# EAGLE design 20200406_FrontBoard_EA_04 (EAGLE 9.5.1)

## Sheet 1 of 2
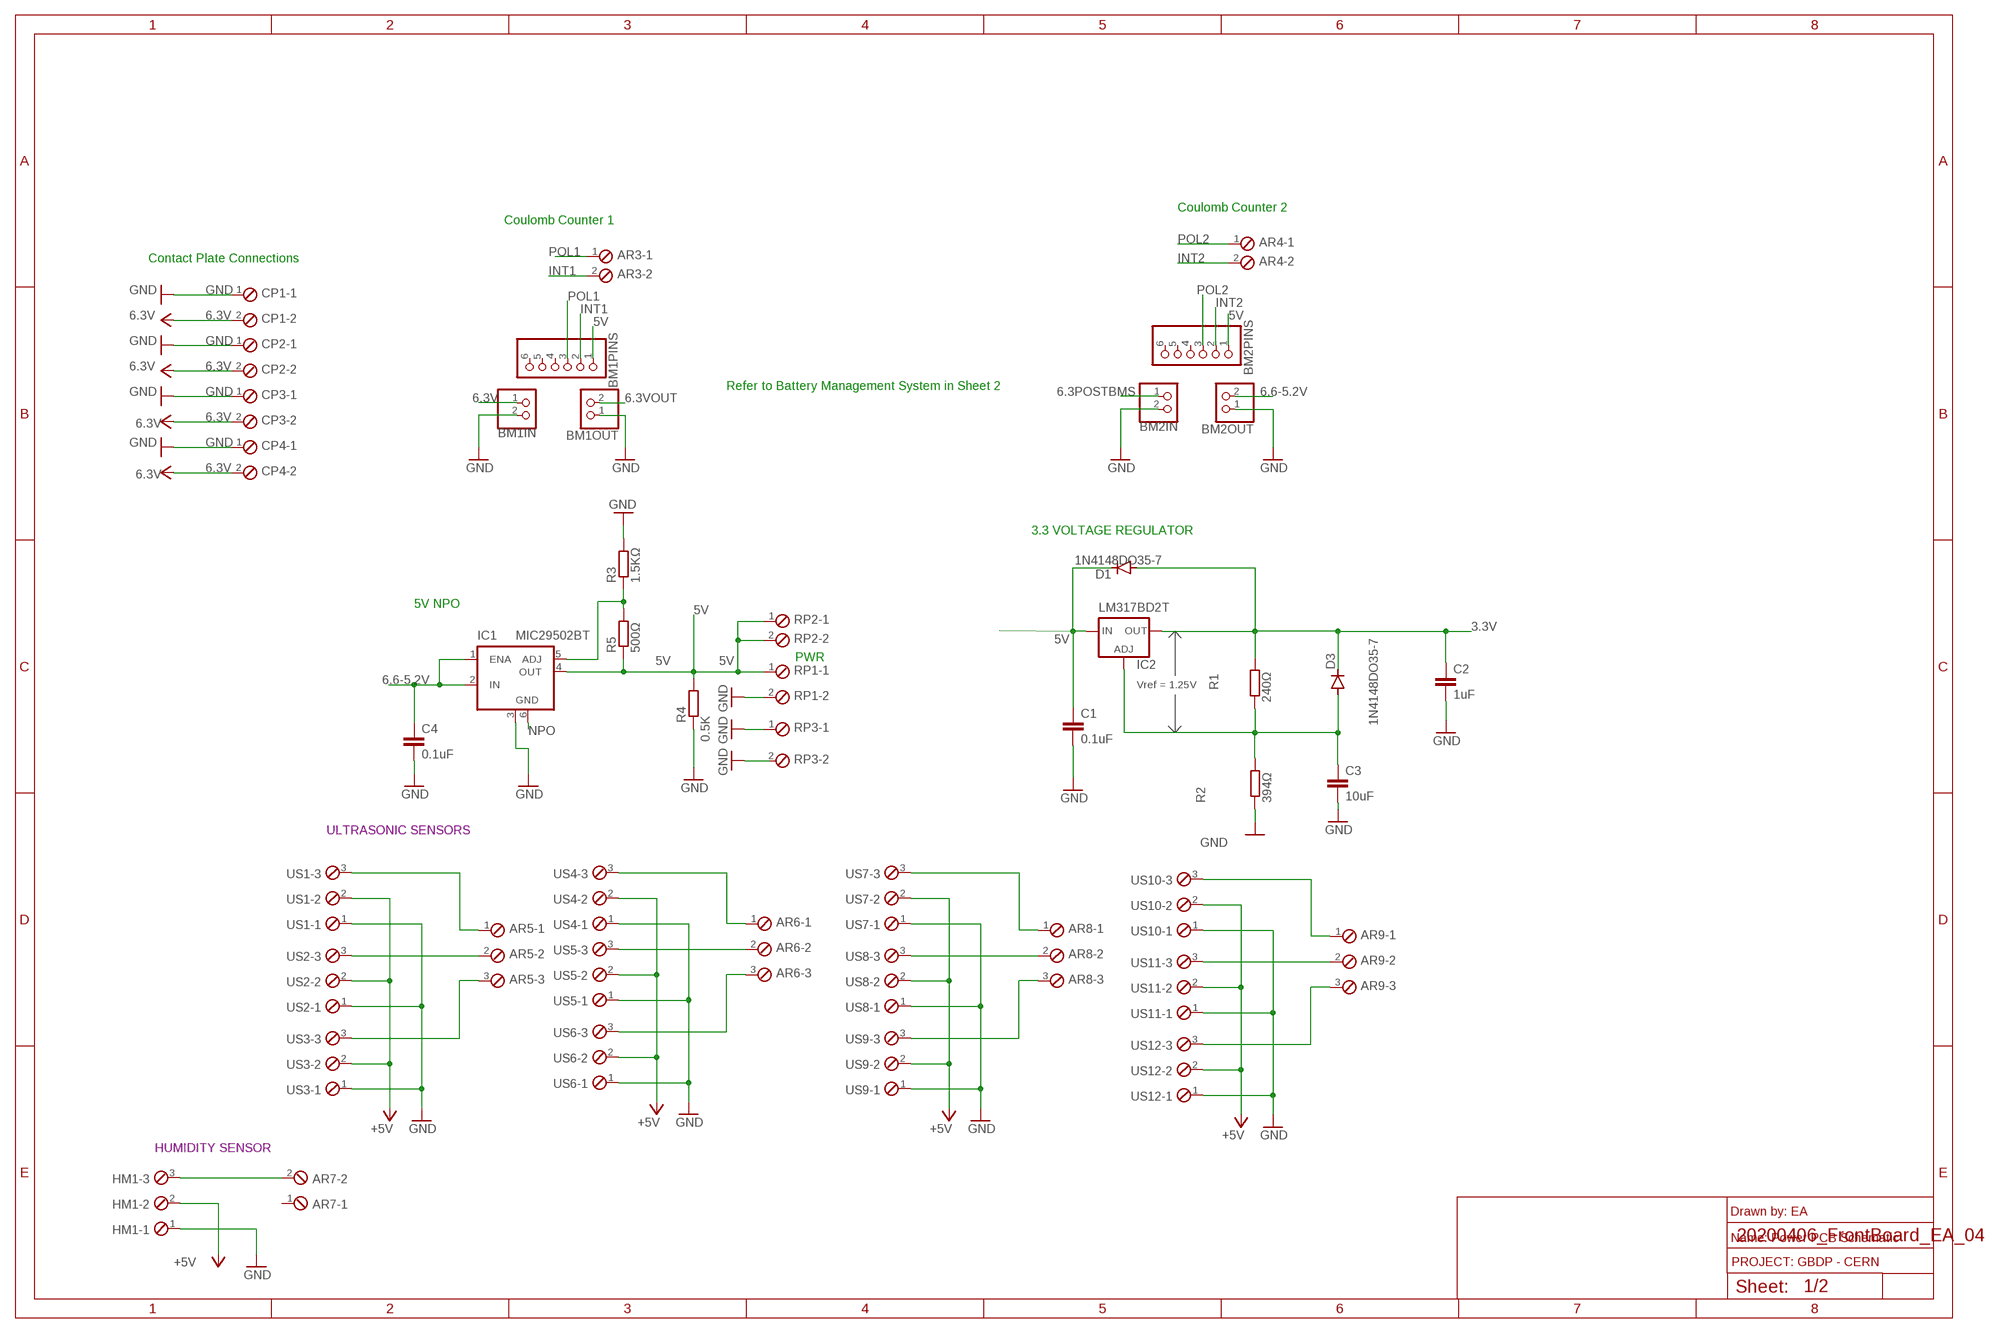
[diagram p0: schematic, sheet 1]

### Parts
AR3  MPT2  [2POL254]
AR4  MPT2  [2POL254]
AR5  MPT3  [3POL254]
AR6  MPT3  [3POL254]
AR7  MPT2  [2POL254]
AR8  MPT3  [3POL254]
AR9  MPT3  [3POL254]
BM1IN  PINHD-1X2  [1X02]
BM1OUT  PINHD-1X2  [1X02]
BM1PINS  PINHD-1X6  [1X06]
BM2IN  PINHD-1X2  [1X02]
BM2OUT  PINHD-1X2  [1X02]
BM2PINS  PINHD-1X6  [1X06]
C1  0.1uF  C-EU025-025X050  [C025-025X050]
C2  1uF  C-EU025-025X050  [C025-025X050]
C3  10uF  C-EU025-025X050  [C025-025X050]
C4  0.1uF  C-EU025-025X050  [C025-025X050]
CP1  MPT2  [2POL254]
CP2  MPT2  [2POL254]
CP3  MPT2  [2POL254]
CP4  MPT2  [2POL254]
D1  1N4148DO35-7  [DO35-7]
D3  1N4148DO35-7  [DO35-7]
HM1  MPT3  [3POL254]
IC1  MIC29502BT  [TO263-5]
IC2  LM317BD2T  [D2PACK]
R1  240Ω  R-EU_0204/7  [0204/7]
R2  394Ω  R-EU_0204/7  [0204/7]
R3  1.5KΩ  R-EU_0204/7  [0204/7]
R4  0.5K  R-EU_0204/7  [0204/7]
R5  500Ω  R-EU_0204/7  [0204/7]
RP1  MPT2  [2POL254]
RP2  MPT2  [2POL254]
RP3  MPT2  [2POL254]
US1  MPT3  [3POL254]
US2  MPT3  [3POL254]
US3  MPT3  [3POL254]
US4  MPT3  [3POL254]
US5  MPT3  [3POL254]
US6  MPT3  [3POL254]
US7  MPT3  [3POL254]
US8  MPT3  [3POL254]
US9  MPT3  [3POL254]
US10  MPT3  [3POL254]
US11  MPT3  [3POL254]
US12  MPT3  [3POL254]

### Nets
3.3V: C2.1 D1.A D3.C IC2.2(OUT) R1.2
5V: BM1PINS.1 BM2PINS.1 C1.1 D1.C IC1.4(OUT) IC2.3(IN) R4.2 R5.1 RP1.1 RP2.1 RP2.2
6.3POSTBMS: BM2IN.1 ; also sheet 2
6.3V: BM1IN.1 CP1.2 CP2.2 CP3.2 CP4.2 ; supply symbol labelled VCC
6.3VOUT: BM1OUT.2 ; also sheet 2
6.6-5.2V: BM2OUT.2 C4.1 IC1.1(ENA) IC1.2(IN)
+5V: HM1.2 US1.2 US2.2 US3.2 US4.2 US5.2 US6.2 US7.2 US8.2 US9.2 US10.2 US11.2 US12.2
GND: BM1IN.2 BM1OUT.1 BM2IN.2 BM2OUT.1 C1.2 C2.2 C3.2 C4.2 CP1.1 CP2.1 CP3.1 CP4.1 HM1.1 IC1.3(GND) R2.1 R3.2 R4.1 RP1.2 RP3.1 RP3.2 US1.1 US2.1 US3.1 US4.1 US5.1 US6.1 US7.1 US8.1 US9.1 US10.1 US11.1 US12.1 ; also sheet 2
INT1: AR3.2 BM1PINS.2
INT2: AR4.2 BM2PINS.2
N$1: C3.1 D3.A IC2.1(ADJ) R1.1 R2.2
N$2: AR8.3 US9.3
N$4: IC1.5(ADJ) R3.1 R5.2
N$6: AR5.3 US3.3
N$9: AR5.2 US2.3
N$13: AR5.1 US1.3
N$14: AR6.3 US6.3
N$15: AR6.2 US5.3
N$16: AR6.1 US4.3
N$17: AR7.2 HM1.3
N$19: AR8.2 US8.3
N$20: AR8.1 US7.3
N$21: AR9.3 US12.3
N$22: AR9.2 US11.3
N$23: AR9.1 US10.3
NPO: IC1.6(GND)
POL1: AR3.1 BM1PINS.3
POL2: AR4.1 BM2PINS.3
Unconnected: AR7.1 BM1PINS.4 BM1PINS.5 BM1PINS.6 BM2PINS.4 BM2PINS.5 BM2PINS.6

### Notes on the sheet
- Coulomb Counter 2
- Coulomb Counter 1
- Contact Plate Connections
- Refer to Battery Management System in Sheet 2
- 3.3 VOLTAGE REGULATOR
- 5V NPO
- PWR
- Vref = 1.25V
- ULTRASONIC SENSORS
- HUMIDITY SENSOR
- Drawn by: EA
- Name: Power PCB Schematic
- PROJECT: GBDP - CERN

## Sheet 2 of 2
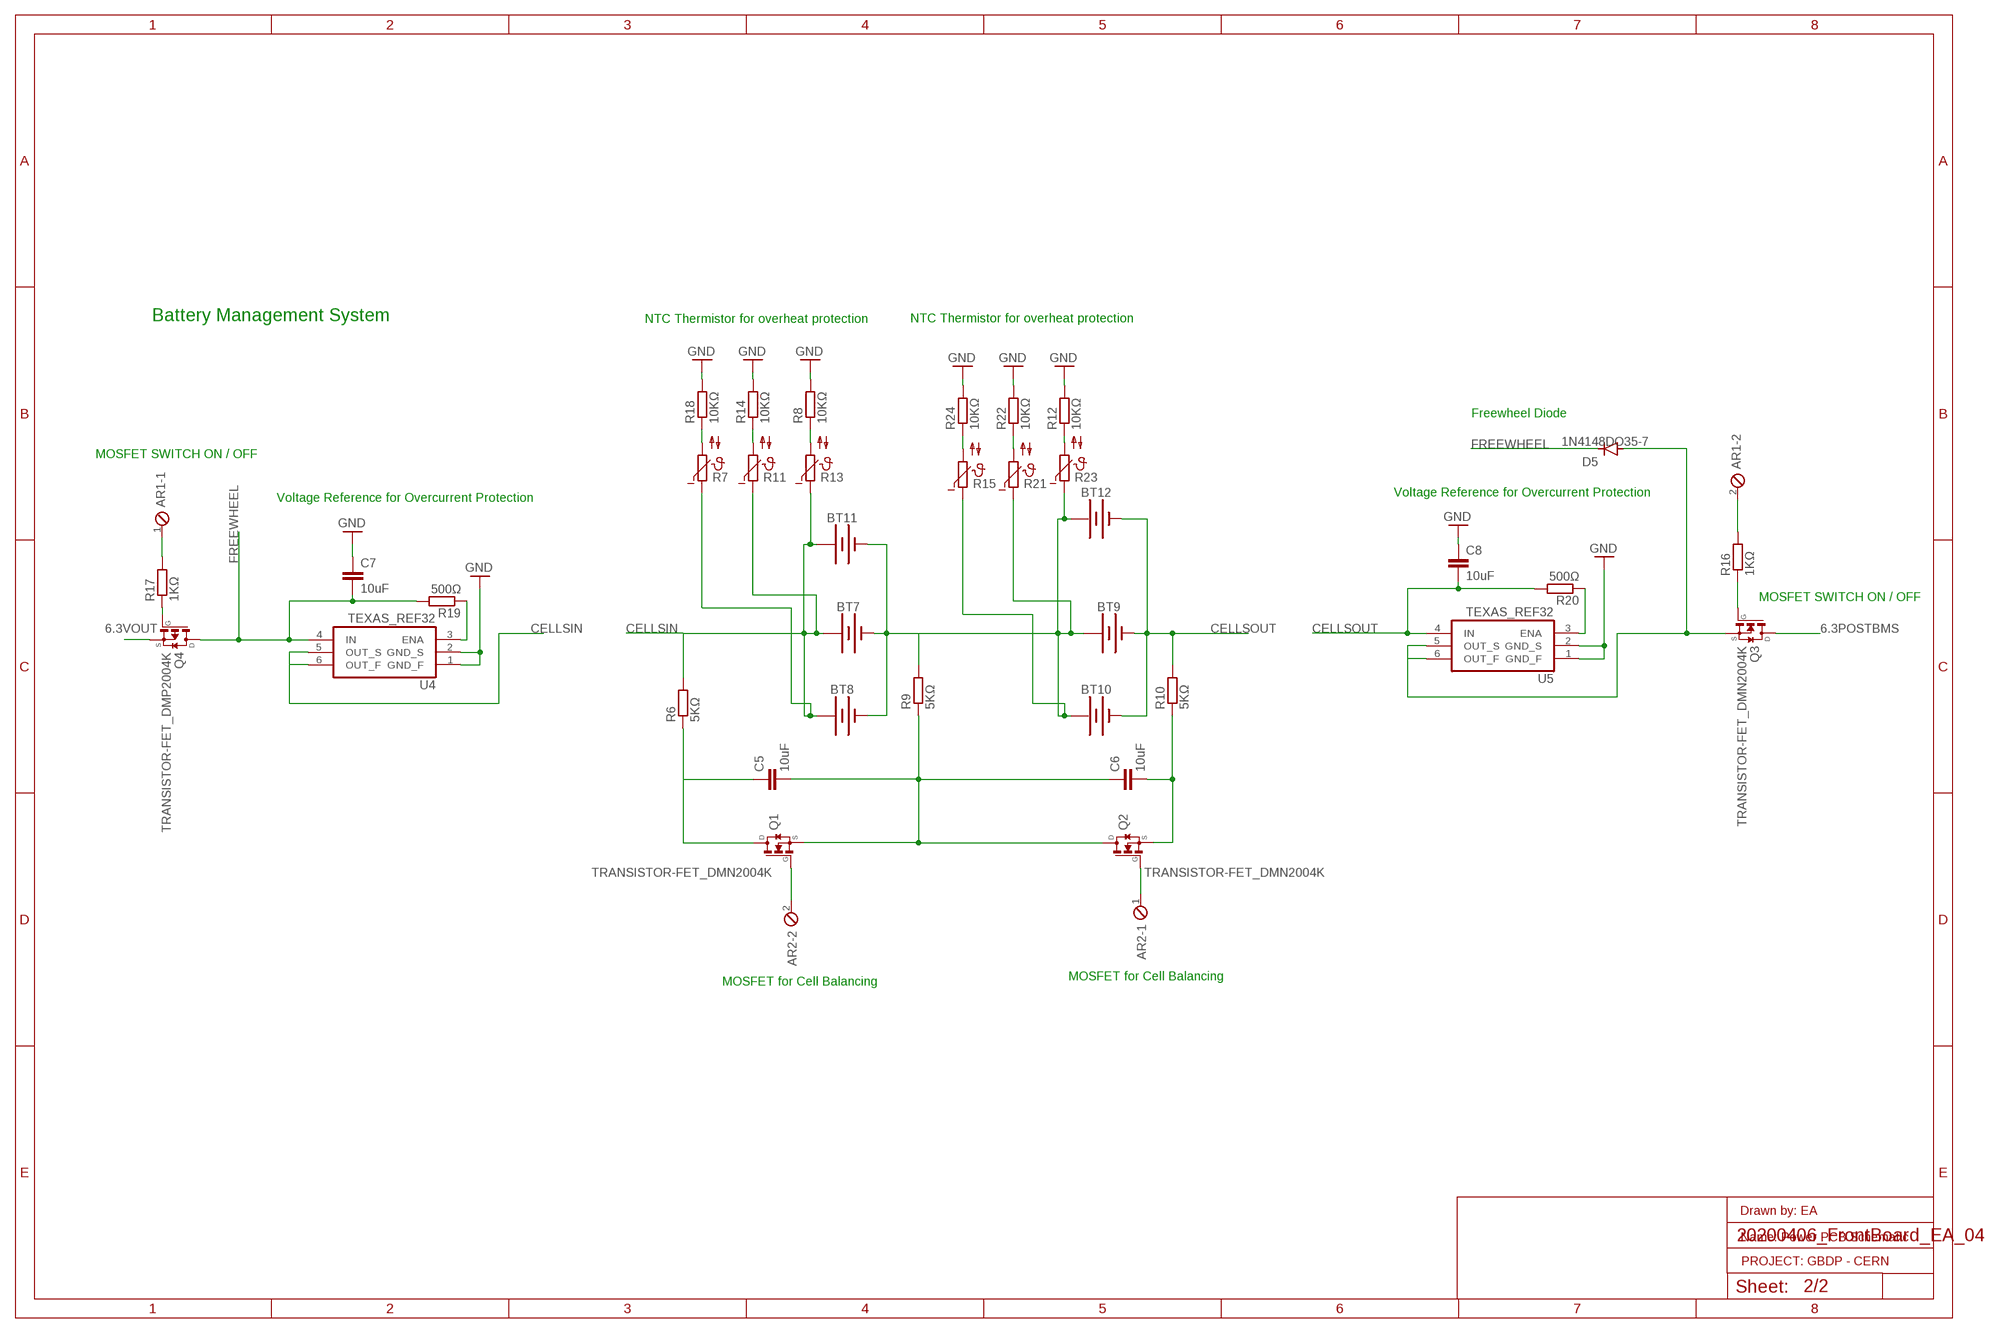
[diagram p1: schematic, sheet 2]

### Parts
AR1  MPT2  [2POL254]
AR2  MPT2  [2POL254]
BT7  BATTERY-18650  [BATTERY_18650-HOLDER]
BT8  BATTERY-18650  [BATTERY_18650-HOLDER]
BT9  BATTERY-18650  [BATTERY_18650-HOLDER]
BT10  BATTERY-18650  [BATTERY_18650-HOLDER]
BT11  BATTERY-18650  [BATTERY_18650-HOLDER]
BT12  BATTERY-18650  [BATTERY_18650-HOLDER]
C5  10uF  C-EU025-025X050  [C025-025X050]
C6  10uF  C-EU025-025X050  [C025-025X050]
C7  10uF  C-EU025-025X050  [C025-025X050]
C8  10uF  C-EU025-025X050  [C025-025X050]
D5  1N4148DO35-7  [DO35-7]
Q1  TRANSISTOR-FET_DMN2004K  [TRANSISTOR-FET_SOT23]
Q2  TRANSISTOR-FET_DMN2004K  [TRANSISTOR-FET_SOT23]
Q3  TRANSISTOR-FET_DMN2004K  [TRANSISTOR-FET_SOT23]
Q4  TRANSISTOR-FET_DMP2004K  [TRANSISTOR-FET_SOT23]
R6  5KΩ  R-EU_0204/7  [0204/7]
R7  NTC640  [P640]
R8  10KΩ  R-EU_0204/7  [0204/7]
R9  5KΩ  R-EU_0204/7  [0204/7]
R10  5KΩ  R-EU_0204/7  [0204/7]
R11  NTC640  [P640]
R12  10KΩ  R-EU_0204/7  [0204/7]
R13  NTC640  [P640]
R14  10KΩ  R-EU_0204/7  [0204/7]
R15  NTC640  [P640]
R16  1KΩ  R-EU_0204/7  [0204/7]
R17  1KΩ  R-EU_0204/7  [0204/7]
R18  10KΩ  R-EU_0204/7  [0204/7]
R19  500Ω  R-EU_0204/7  [0204/7]
R20  500Ω  R-EU_0204/7  [0204/7]
R21  NTC640  [P640]
R22  10KΩ  R-EU_0204/7  [0204/7]
R23  NTC640  [P640]
R24  10KΩ  R-EU_0204/7  [0204/7]
U4  TEXAS_REF32  [TEXAS_SOT23-6]
U5  TEXAS_REF32  [TEXAS_SOT23-6]

### Nets
6.3POSTBMS: Q3.3(D) ; also sheet 1
6.3VOUT: Q4.2(S) ; also sheet 1
CELLSIN: BT7.PWR@1(+) BT8.PWR@1(+) BT11.PWR@1(+) R6.2 R7.1 R11.1 R13.1 U4.5(OUT_S) U4.6(OUT_F)
CELLSOUT: BT9.GND@1(-) BT10.GND@1(-) BT12.GND@1(-) C8.2 R10.2 R20.2 U5.4(IN)
FREEWHEEL: C7.2 D5.C Q4.3(D) R19.2 U4.4(IN)
GND: C7.1 C8.1 R8.2 R12.2 R14.2 R18.2 R22.2 R24.2 U4.1(GND_F) U4.2(GND_S) U5.1(GND_F) U5.2(GND_S) ; also sheet 1
N$5: C5.2 C6.1 Q1.2(S) Q2.3(D) R9.1
N$7: C6.2 Q2.2(S) R10.1
N$8: AR2.2 Q1.1(G)
N$10: AR2.1 Q2.1(G)
N$12: AR1.2 R16.2
N$18: D5.A Q3.2(S) U5.5(OUT_S) U5.6(OUT_F)
N$24: Q3.1(G) R16.1
N$25: Q4.1(G) R17.1
N$26: AR1.1 R17.2
N$27: R8.1 R13.2
N$28: R21.2 R22.1
N$29: C5.1 Q1.3(D) R6.1
N$30: R19.1 U4.3(ENA)
N$32: R12.1 R23.2
N$33: R20.1 U5.3(ENA)
N$35: R11.2 R14.1
N$36: R7.2 R18.1
N$37: BT7.GND@1(-) BT8.GND@1(-) BT9.PWR@1(+) BT10.PWR@1(+) BT11.GND@1(-) BT12.PWR@1(+) R9.2 R15.1 R21.1 R23.1
N$38: R15.2 R24.1

### Notes on the sheet
- Battery Management System | NTC Thermistor for overheat protection | NTC Thermistor for overheat protection
- Freewheel Diode
- MOSFET SWITCH ON / OFF
- Voltage Reference for Overcurrent Protection
- Voltage Reference for Overcurrent Protection
- MOSFET SWITCH ON / OFF
- MOSFET for Cell Balancing
- MOSFET for Cell Balancing
- Drawn by: EA
- Name: Power PCB Schematic
- PROJECT: GBDP - CERN

## Library data of the parts
AR1-AR4 AR7 CP1-CP4 RP1-RP3 = con-phoenix-254_edited:MPT2: PHOENIX CONNECTOR; OC_FARNELL: unknown; OC_NEWARK: unknown
AR5 AR6 AR8 AR9 HM1 US1-US12 = con-phoenix-254_edited:MPT3: PHOENIX CONNECTOR; OC_FARNELL: unknown; OC_NEWARK: unknown
BM1IN BM1OUT BM2IN BM2OUT = pinhead:PINHD-1X2: PIN HEADER
BM1PINS BM2PINS = pinhead:PINHD-1X6: PIN HEADER
BT7-BT12 = SparkFun-Batteries_edited:BATTERY: Battery - Single Cell A variety of battery chemistries, sizes, and footprints. Device List: 20MM_PTH - Coin Cell Battery Holder - 20mm (PTH) <https://www.sparkfun.com/products/783> 6.8MM_PTH - Coin Cell Battery Holder - 6.8MM(SMD) <https://www.digikey.com/product-detail/en/seiko-instruments/MS621FE-FL11E/728-1057-ND/1889208?WT.srch=1&gclid=CNOQ5a6LzdQCFZS2wAodXCkE0g> 12MM_SMD - Coin Cell Battery Holder - 12mm (SMD) <https://www.sparkfun.com/products/10592> 12MM_PTH - Coin Cell Battery Holder - 12mm (PTH) <https://www.sparkfun.com/products/7948> 20MM_SMD - 20mm Coin Cell Battery Holder (SMD) (2 legs) Used on the Big Time Watch Kit <https://www.sparkfun.com/products/11734> 20MM_SMD_4LEGS - Coin Cell Battery Holder - 20mm (SMD) <https://www.sparkfun.com/products/11892> 20MM_SMD_4LEGS_OVERPASTE - Coin Cell Battery Holder - 20mm (SMD) <https://www.sparkfun.com/products/11892> (Over-paste on the legs) 24.5MM_PTH - Coin Cell Battery Holder - 24.5mm (PTH) <https://www.sparkfun.com/products/8863> 9V - 9V Battery Holder - PC Mount Used on the SparkFun SparkPunk Sound Kit <https://www.sparkfun.com/products/11177> and SparkFun SparkPunk Sequencer Kit <https://www.sparkfun.com/products/12707> 18650 - Battery Holder - 18650 (PTH) <https://www.sparkfun.com/products/13113> AA - Battery Holder - 1xAA (PTH) <https://www.sparkfun.com/products/7949> AAA - Battery Holder - 1xAAA (PTH) <https://www.sparkfun.com/products/12718> AA_KIT - Battery Holder - 1xAA (PTH) <https://www.sparkfun.com/products/7949> Special kit package - pads only have exposed copper on one side of the board. AAA_KIT - Battery Holder - 1xAAA (PTH) <https://www.sparkfun.com/products/12718> Special kit package - pads only have exposed copper on one side of the board.; PROD_ID: BATT-12327; SF_SKU: PRT-13113
C1-C8 = rcl:C-EU: CAPACITOR, European symbol; SPICEPREFIX: C
D1 D3 D5 = diode:1N4148: DIODE high speed (Philips)
IC1 = my_mixed:MIC29502BT: Adjustable Voltage Regulator
IC2 = v-reg:LM317?*: 500 mA Adjustable Output Positive Voltage Regulator Source: http://www.onsemi.co.jp .. LM317M-D.PDF
Q1-Q3 = 52101-101-REV-A:TRANSISTOR-FET_DMN2004K: N-Channel Enhancement MOSFET
Q4 = 52101-101-REV-A:TRANSISTOR-FET_DMP2004K: P-Channel Enhancement MOSFET
R1-R6 R8-R10 R12 R14 R16-R20 R22 R24 = rcl:R-EU_: RESISTOR, European symbol; SPICEPREFIX: R
R7 R11 R13 R15 R21 R23 = ptc-ntc_edited:NTC640: PHILIPS NTC; OC_FARNELL: unknown; OC_NEWARK: unknown
U4 U5 = 52101-101-REV-A:TEXAS_REF32*: VOLTAGE REFERENCE Low-Noise, Very Low Drift, Precision

## Module BATTERYMANAGEMENT
Ports: 

### Library data of the parts

## Board
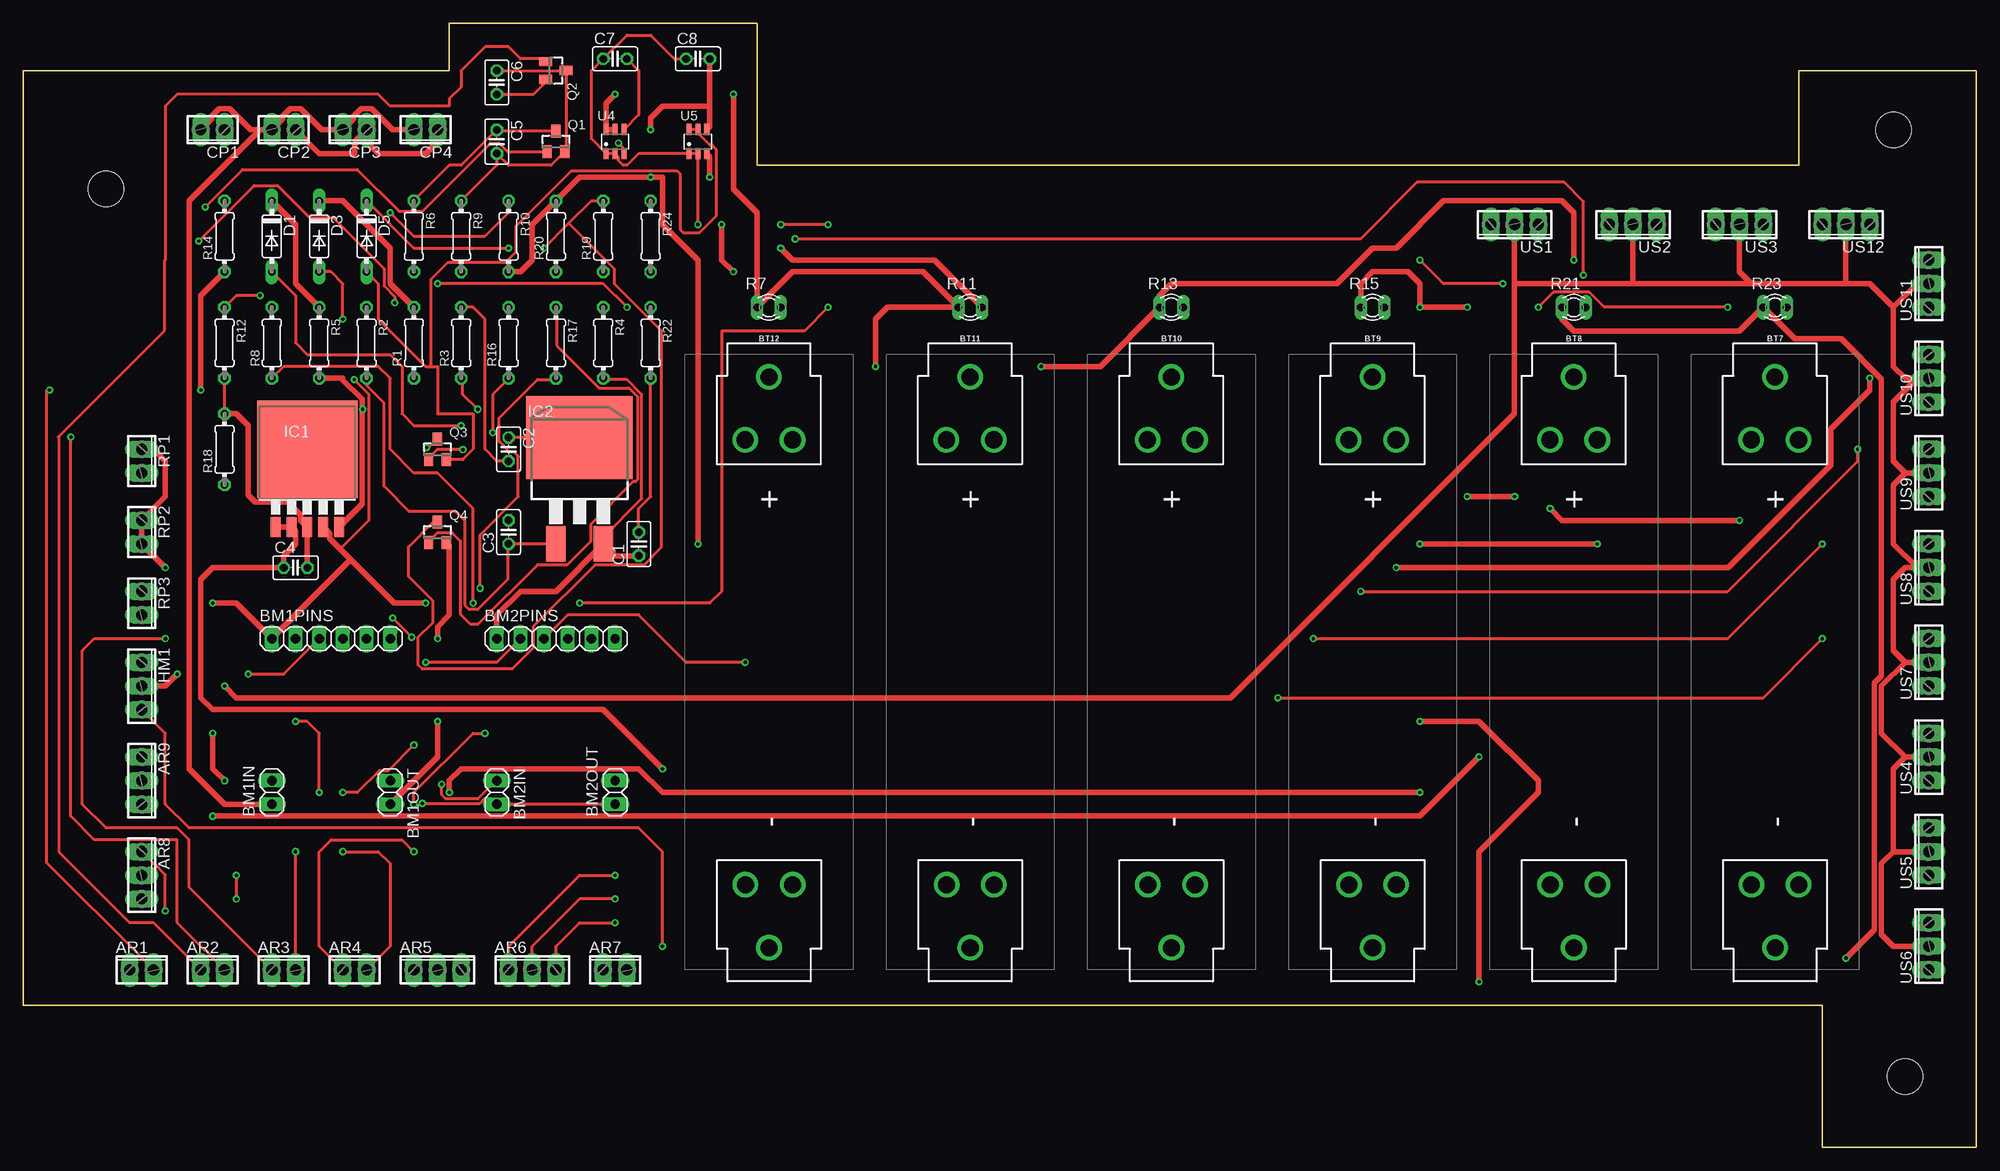
[diagram p2: board, top side]
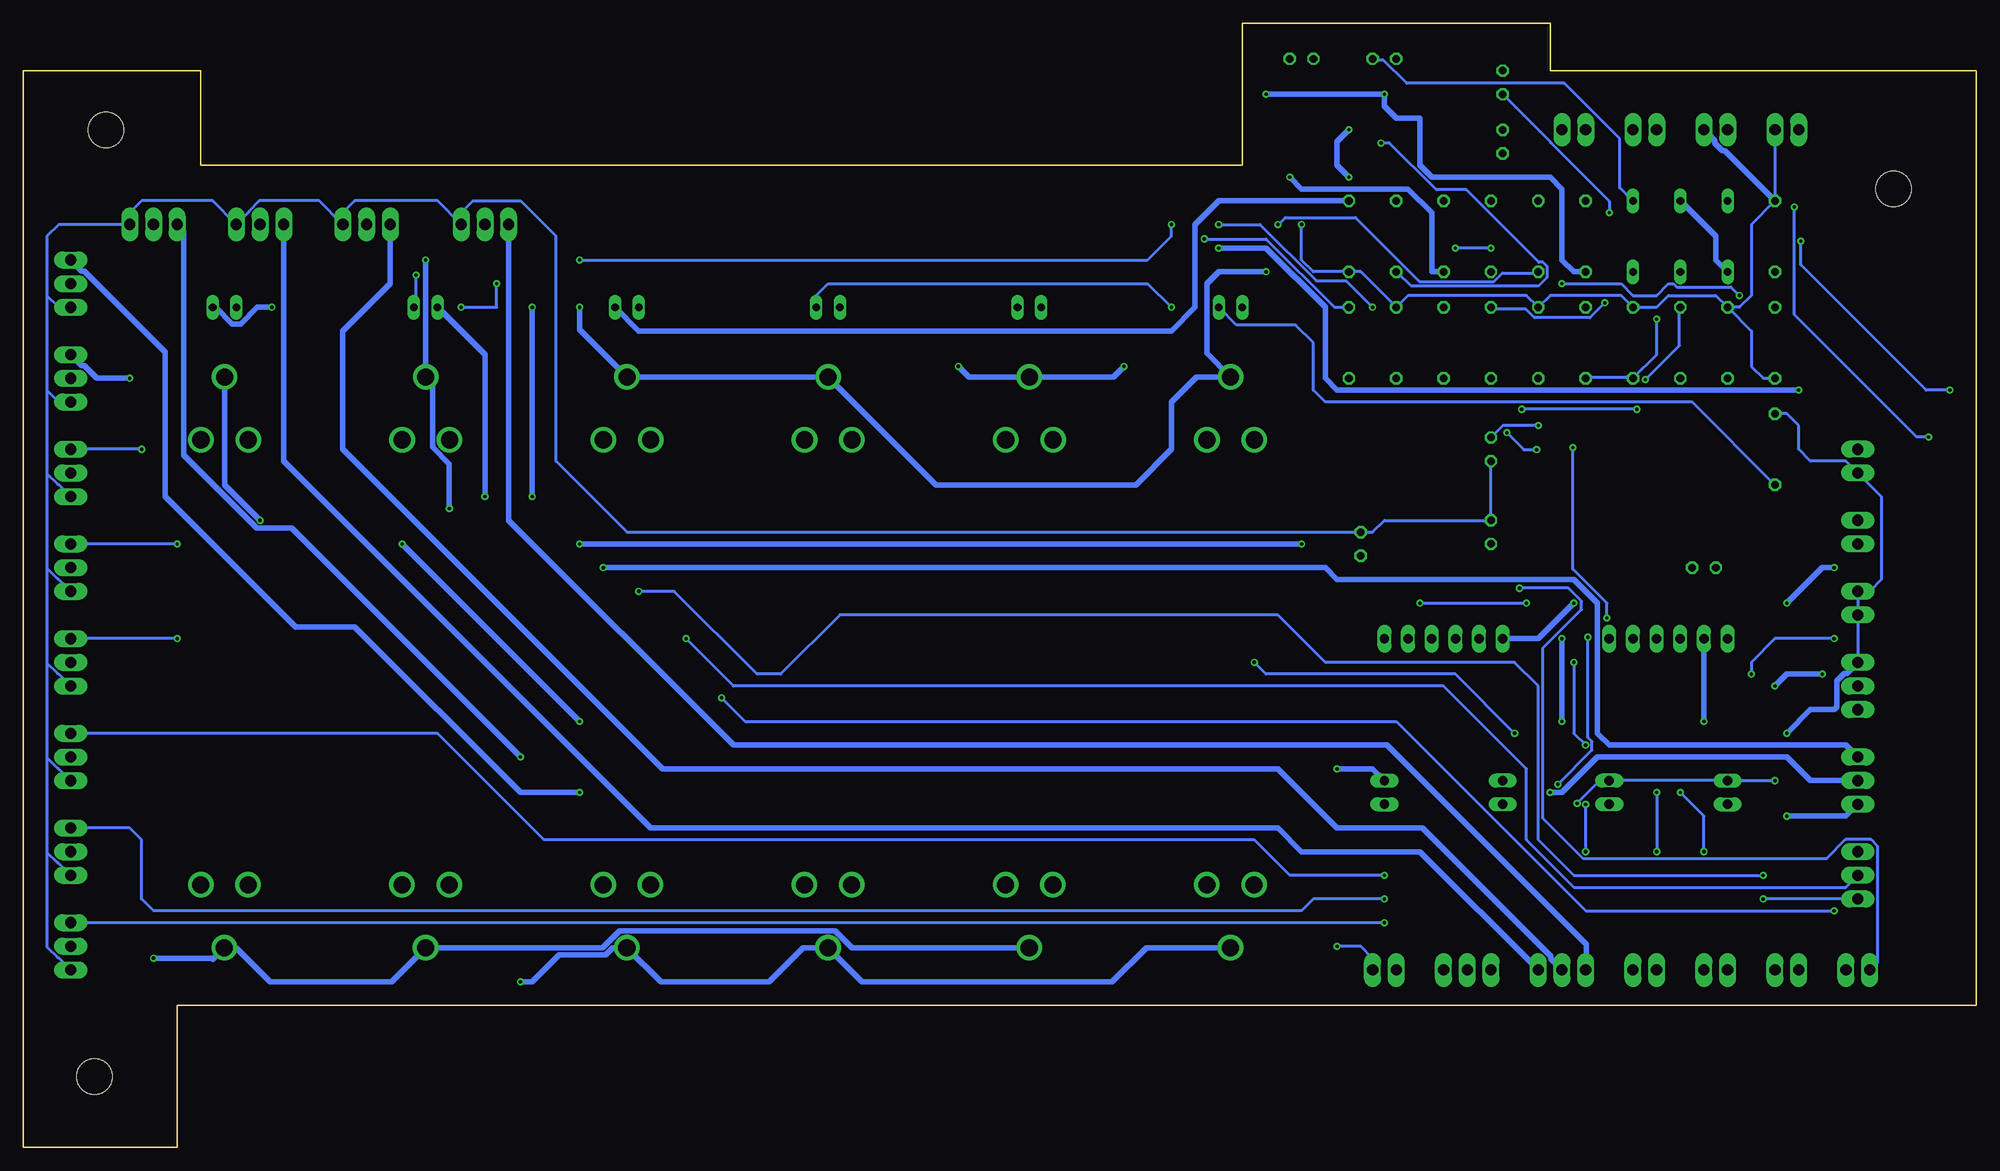
[diagram p3: board, bottom side, seen from below]

Size 209.55 x 120.65 mm. Coordinates in mm from the lower left corner, seen from the top.
Outline: 0,15.24 0,115.57 45.72,115.57 45.72,120.65 78.74,120.65 78.74,105.41 190.5,105.41 190.5,115.57 209.55,115.57 209.55,0 193.04,0 193.04,15.24 0,15.24
Copper layers (1*16): Top 0.035mm / dielectric 1.5mm / Bottom 0.035mm
Design rules "default *": minimum track width 12mil, minimum drill 0.35mm, track to track 6mil, track to pad 6mil, pad to pad 6mil, via to via 6mil, smd to smd 6mil, copper to edge 40mil, drill to drill 6mil, minimum pad ring 10mil, minimum via ring 8mil, stop-mask expansion 4mil, vias tented up to drill 0mil, thermal gap 10mil
Holes 3.81 mm at 8.89,102.87 200.66,109.22 201.93,7.62

### Footprints (pad centres in the part's own frame; a part is rotated, then mirrored left to right if it is on the bottom)
2POL254 = drill 1.2 long: 1 -1.27,0; 2 1.27,0
3POL254 = drill 1.2 long: 1 -2.54,0; 2 0,0; 3 2.54,0
1X02 = drill 1.016 long: 1 -1.27,0; 2 1.27,0
1X06 = drill 1.016 long: 1 -6.35,0; 2 -3.81,0; 3 -1.27,0; 4 1.27,0; 5 3.81,0; 6 6.35,0
BATTERY_18650-HOLDER = drill 1.829: GND@1 30.628,0.01; GND@2 23.88,2.55; GND@3 23.88,-2.53; PWR@1 -30.628,-0.01; PWR@2 -23.88,2.53; PWR@3 -23.88,-2.55
C025-025X050 = drill 0.813 octagon: 1 -1.27,0; 2 1.27,0
DO35-7 = drill 0.813 long: A 3.81,0; C -3.81,0
TO263-5 = smd 1.067 x 2.159: 1 -3.404,-5.791; 2 -1.702,-5.791; 3 0,-5.791; 4 1.702,-5.791; 5 3.404,-5.791 | smd 10.8 x 10.41: 6 0,2.54
D2PACK = smd 2.083 x 3.81: 1 -2.54,-8.89; 3 2.54,-8.89 | smd 11.43 x 8.89: 2 0,2.54
TRANSISTOR-FET_SOT23 = smd 1 x 1.4: 1 -0.95,-1.1; 2 0.95,-1.1; 3 0,1.1
0204/7 = drill 0.813 octagon: 1 -3.81,0; 2 3.81,0
P640 = drill 0.813 long: 1 -1.27,0; 2 1.27,0
TEXAS_SOT23-6 = smd 0.55 x 1.2: 1 -0.95,-1.3; 2 0,-1.3; 3 0.95,-1.3; 4 0.95,1.3; 5 0,1.3; 6 -0.95,1.3

### Placement (x,y rotation side)
AR1  12.7,19.05 0 top
AR2  20.32,19.05 0 top
AR3  27.94,19.05 0 top
AR4  35.56,19.05 0 top
AR5  44.45,19.05 0 top
AR6  54.61,19.05 0 top
AR7  63.5,19.05 0 top
AR8  12.7,29.21 270 top
AR9  12.7,39.37 270 top
BM1IN  26.67,38.1 90 top
BM1OUT  39.37,38.1 270 top
BM1PINS  33.02,54.61 0 top
BM2IN  50.8,38.1 270 top
BM2OUT  63.5,38.1 90 top
BM2PINS  57.15,54.61 0 top
BT7  187.96,52.07 270 top
BT8  166.37,52.07 270 top
BT9  144.78,52.07 270 top
BT10  123.19,52.07 270 top
BT11  101.6,52.07 270 top
BT12  80.01,52.07 270 top
C1  66.04,64.77 90 top
C2  52.07,74.93 270 top
C3  52.07,66.04 90 top
C4  29.21,62.23 0 top
C5  50.8,107.95 270 top
C6  50.8,114.3 270 top
C7  63.5,116.84 0 top
C8  72.39,116.84 0 top
CP1  20.32,109.22 180 top
CP2  27.94,109.22 180 top
CP3  35.56,109.22 180 top
CP4  43.18,109.22 180 top
D1  26.67,97.79 270 top
D3  31.75,97.79 270 top
D5  36.83,97.79 270 top
HM1  12.7,49.53 270 top
IC1  30.48,72.39 0 top
IC2  59.69,73.66 0 top
Q1  57.15,107.95 0 top
Q2  57.15,115.57 270 top
Q3  44.45,74.93 0 top
Q4  44.45,66.04 0 top
R1  41.91,86.36 90 top
R2  36.83,86.36 270 top
R3  46.99,86.36 90 top
R4  62.23,86.36 270 top
R5  31.75,86.36 270 top
R6  41.91,97.79 270 top
R7  80.01,90.17 0 top
R8  26.67,86.36 90 top
R9  46.99,97.79 270 top
R10  52.07,97.79 270 top
R11  101.6,90.17 0 top
R12  21.59,86.36 270 top
R13  123.19,90.17 0 top
R14  21.59,97.79 90 top
R15  144.78,90.17 0 top
R16  52.07,86.36 90 top
R17  57.15,86.36 270 top
R18  21.59,74.93 90 top
R19  62.23,97.79 90 top
R20  57.15,97.79 90 top
R21  166.37,90.17 0 top
R22  67.31,86.36 270 top
R23  187.96,90.17 0 top
R24  67.31,97.79 270 top
RP1  12.7,73.66 270 top
RP2  12.7,66.04 270 top
RP3  12.7,58.42 270 top
U4  63.5,107.95 0 top
U5  72.39,107.95 0 top
US1  160.02,99.06 180 top
US2  172.72,99.06 180 top
US3  184.15,99.06 180 top
US4  204.47,41.91 90 top
US5  204.47,31.75 90 top
US6  204.47,21.59 90 top
US7  204.47,52.07 90 top
US8  204.47,62.23 90 top
US9  204.47,72.39 90 top
US10  204.47,82.55 90 top
US11  204.47,92.71 90 top
US12  195.58,99.06 180 top

### Tracks (layer width: path | path; a pad name or v marks a point on that pad's centre or on a via)
3.3V  (via drill 0.35)
  Top 0.305: D1.A 29.21,91.44 29.21,86.36 30.48,85.09 39.37,85.09 40.64,83.82 40.64,78.74 41.91,77.47 v46.99,77.47 | IC2.2 59.51,76.25 52.2,76.25 C2.1
  Top 0.61: R1.2 39.37,92.71 39.37,96.52 34.29,101.6 D3.C
  Bottom 0.305: v46.99,77.47 50.8,77.47 C2.1
  Bottom 0.61: D3.C 27.94,97.79 27.94,95.25 D1.A
5V  (via drill 0.35)
  Top 0.305: R4.2 62.25,82.42 64.77,82.42 66.37,80.82 66.37,69.62 62.25,65.51 62.25,65.05 IC2.3 | v35.51,82.42 37.11,80.82 37.11,67.33 34,64.22
  Top 0.61: RP1.1 13.97,74.93 15.24,73.66 15.24,69.85 RP2.1 RP2.2 v15.24,62.23 | v20.32,58.42 22.86,58.42 BM1PINS.1 35.14,63.08 | D1.C 29.21,99.06 29.21,92.71 R5.1 | C1.1 63.5,63.5 IC2.3 57.15,59.69 53.34,59.69 50.8,57.15 BM2PINS.1 | IC1.4 32.89,65.89 32.89,65.33 34,64.22 35.14,63.08 | v43.18,58.42 39.8,58.42 35.14,63.08
  Bottom 0.305: v35.51,82.42 31.85,86.08 31.85,89.97 R5.1
  Bottom 0.61: v15.24,62.23 16.51,62.23 v20.32,58.42 | BM2PINS.1 46.99,54.61 v43.18,58.42
6.3POSTBMS  (via drill 0.35)
  Top 0.305: v43.28,75.11 43.51,75.11 44.42,76.02 Q3.3 | v41.68,54.76 v39.62,56.82 | v44.88,38.99 44.88,37.85 45.34,37.39 48.77,37.39 50.6,39.22 BM2IN.1
  Bottom 0.305: v43.28,75.11 43.28,62.08 39.62,58.42 v39.62,56.82 | v41.68,54.76 41.68,44.02 41.22,43.56 41.22,42.65 v44.88,38.99
6.3V
  Top 0.61: CP1.2 20.23,110.4 20.23,110.68 21.03,111.48 22.15,111.48 24.41,109.22 CP2.2 | CP2.2 27.85,110.4 27.85,110.68 28.65,111.48 29.77,111.48 32.03,109.22 CP3.2 35.47,110.4 35.47,110.68 36.27,111.48 37.39,111.48 39.65,109.22 CP4.2 | CP2.2 25.4,109.22 17.78,101.6 17.78,40.64 21.59,36.83 BM1IN.1
6.3VOUT  (via drill 0.35)
  Top 0.61: BM1OUT.2 44.45,41.91 v44.45,45.72 | v44.45,54.61 44.45,55.88 45.72,57.15 45.72,64.62 Q4.2
  Bottom 0.61: v44.45,45.72 v44.45,54.61
6.6-5.2V  (via drill 0.35)
  Top 0.61: IC1.1 IC1.2 29.21,66.17 29.21,64.77 27.94,63.5 C4.1 20.32,62.23 19.05,60.96 19.05,48.26 20.32,46.99 62.23,46.99 v68.58,40.64
  Bottom 0.61: BM2OUT.2 64.77,40.64 v68.58,40.64
+5V  (via drill 0.35)
  Top 0.61: HM1.2 15.24,49.53 v16.51,50.8 | v21.59,49.53 22.86,48.26 129.54,48.26 160.02,78.74 160.02,92.71 | 160.02,92.71 US1.2 | US6.2 200.66,21.59 199.39,22.86 199.39,30.48 200.66,31.75 | 200.66,31.75 US5.2 | 200.66,31.75 200.66,40.64 201.93,41.91 | US4.2 201.93,41.91 | 201.93,41.91 199.39,44.45 199.39,49.53 201.93,52.07 | US7.2 201.93,52.07 | 201.93,52.07 200.66,53.34 200.66,60.96 201.93,62.23 US8.2 203.2,62.23 200.66,64.77 200.66,71.12 201.93,72.39 | US9.2 201.93,72.39 | 201.93,72.39 200.66,73.66 200.66,80.01 203.2,82.55 US10.2 201.93,82.55 200.66,83.82 200.66,90.17 | US11.2 203.2,92.71 200.66,90.17 | 200.66,90.17 198.12,92.71 195.58,92.71 | 195.58,92.71 US12.2 | 195.58,92.71 185.42,92.71 | 185.42,92.71 184.15,93.98 US3.2 | 185.42,92.71 172.72,92.71 | 172.72,92.71 US2.2 | 172.72,92.71 160.02,92.71
  Bottom 0.61: v16.51,50.8 20.32,50.8 v21.59,49.53
CELLSIN  (via drill 0.35)
  Top 0.61: v76.2,113.03 76.2,102.87 78.74,100.33 R7.1 82.55,93.98 96.52,93.98 R11.1 92.71,90.17 91.44,88.9 v91.44,83.82 | v63.5,113.03 62.55,112.08 U4.6 U4.5 | v109.22,83.82 115.57,83.82 R13.1 121.92,91.44 123.19,92.71 140.97,92.71 144.78,96.52 147.32,96.52 152.4,101.6 165.1,101.6 166.37,100.33 v166.37,95.25 | v184.15,67.31 165.1,67.31 v163.83,68.58
  Bottom 0.61: R6.2 43.18,93.98 44.45,95.25 44.45,102.87 45.72,104.14 58.42,104.14 59.69,105.41 59.69,110.49 62.23,110.49 63.5,111.76 v63.5,113.03 v76.2,113.03 | v109.22,83.82 108.1,82.7 BT11.PWR@1 92.56,82.7 v91.44,83.82 | BT7.PWR@1 187.95,71.11 v184.15,67.31 | v163.83,68.58 163.83,73.37 165.65,75.19 165.65,81.99 BT8.PWR@1 v166.36,95.24 v166.37,95.25
CELLSOUT  (via drill 0.35)
  Top 0.61: R10.2 53.34,93.98 54.61,95.25 54.61,99.06 R20.2 59.69,104.14 v67.31,104.14 68.58,104.14 68.58,99.06 72.39,95.25 v72.39,64.77 | C8.2 73.66,111.76 | 73.66,111.76 73.66,109.57 U5.4 | 73.66,111.76 68.58,111.76 67.31,110.49 v67.31,109.22 | v156.21,17.78 156.21,31.75 162.56,38.1 162.56,39.37 156.21,45.72 v149.86,45.72 | v168.91,64.77 v149.86,64.77
  Bottom 0.61: v67.31,104.14 68.58,105.41 68.58,107.95 v67.31,109.22 | BT12.GND@1 89.05,21.44 92.71,17.78 119.54,17.78 BT10.GND@1 125.88,21.44 129.54,17.78 141.13,17.78 BT9.GND@1 146.3,21.44 147.06,20.68 152.04,20.68 154.94,17.78 v156.21,17.78 | v149.86,45.72 v168.91,64.77 | v149.86,64.77 v72.39,64.77
FREEWHEEL  (via drill 0.35)
  Top 0.305: C7.2 66.04,115.57 66.04,110.84 U4.4 | D5.C 41.91,96.52 v52.07,96.52 | v55.88,96.52 58.53,99.17 | 58.53,99.17 60.96,101.6 R19.2 | 58.53,99.17 63.4,94.31 63.4,92.71 68.43,87.68 68.43,64.36 66.6,62.53 61.34,62.53 54.71,55.91 54.71,53.62 52.43,51.33 42.82,51.33 42.37,51.79 42.37,54.76 43.97,56.36 43.97,58.65 41.33,61.29 41.33,64.47 43.97,67.11 44.42,67.11 Q4.3
  Bottom 0.305: v52.07,96.52 v55.88,96.52 | C7.2 64.77,116.71 63.63,116.71 61.11,114.2 44.2,114.2 38.25,108.26 38.25,103 36.88,101.62 D5.C
GND  (via drill 0.35)
  Top 0.305: v72.39,99.06 U5.2 U5.1 66.01,106.65 64.77,105.41 64.38,105.41 63.87,105.92 63.87,106.28 U4.2 U4.1 60.96,108.24 60.96,115.57 C7.1 64.77,119.38 67.31,119.38 69.85,116.84 C8.1 | C1.2 66.04,68.58 67.31,69.85 R22.2 | C2.2 50.8,73.66 49.53,74.93 49.53,88.9 48.26,90.17 R3.2 | BM2OUT.1 BM2IN.2 51.28,36.93 50.83,37.39 49.45,37.39 49,36.93 v42.82,36.93 | R18.2 R12.2
  Top 0.61: C4.2 IC1.3 29.77,67.31 29.77,67.87 28.37,69.27 24.89,69.27 24.13,70.03 24.13,77.47 22.86,78.74 R18.2 | v21.59,39.37 20.32,40.64 v20.32,44.45 | CP4.1 44.45,107.95 43.18,106.68 38.1,106.68 36.83,107.95 CP3.1 35.65,108.04 35.65,107.76 35.56,107.67 35.56,106.68 31.75,106.68 CP2.1
  Bottom 0.305: CP1.1 R14.2 24.13,99.06 24.13,91.44 25.4,90.17 R8.2 | 14.1,50.73 14.04,50.73 HM1.1 RP3.2 RP3.1 11.43,59.69 10.16,60.96 10.16,69.85 RP1.2 13.97,73.66 17.78,73.66 19.05,74.93 19.05,77.47 20.32,78.74 R18.2 | v21.59,39.37 BM1IN.2 BM1OUT.1 39.39,39.22 40.54,39.22 v42.82,36.93 | R8.2 24.13,87.63 24.13,83.82 22.86,82.55 R12.2 | R8.2 27.94,91.44 33.02,91.44 34.29,90.17 R2.1 38.1,91.44 45.72,91.44 R3.2 48.26,91.44 60.96,91.44 R4.1 66.04,93.98 R24.2 71.12,93.98 72.39,95.25 v72.39,99.06 | 207.01,91.44 207.01,97.79 205.74,99.06 US12.1 198.12,100.33 196.85,101.6 189.23,101.6 US3.1 185.36,100.39 185.36,100.46 184.21,101.6 177.8,101.6 US2.1 175.26,100.33 173.99,101.6 165.1,101.6 US1.1 162.56,100.33 161.29,101.6 156.21,101.6 152.4,97.79 152.4,73.66 144.78,66.04 C1.2 64.77,66.04 63.5,67.31 C3.2 C2.2 | 207.01,91.44 205.74,90.17 US11.1 | 207.01,91.44 207.01,81.28 | 207.01,81.28 205.74,80.01 US10.1 | US9.1 205.81,71.19 205.87,71.19 207.01,72.33 | 207.01,81.28 207.01,72.33 | US8.1 205.81,61.03 205.87,61.03 207.01,62.17 | 207.01,72.33 207.01,62.17 | US7.1 205.81,50.86 205.87,50.86 207.01,52.01 | 207.01,62.17 207.01,52.01 | US4.1 205.81,40.7 205.87,40.7 207.01,41.85 | 207.01,52.01 207.01,41.85 | US5.1 205.81,30.54 205.87,30.54 207.01,31.69 | 207.01,41.85 207.01,31.69 | US6.1 205.81,20.38 205.87,20.38 207.01,21.53 207.01,31.69
  Bottom 0.61: v20.32,44.45 17.78,46.99 15.24,46.99 14.96,47.27 14.96,50.09 14.16,50.89 13.88,50.89 HM1.1 | CP2.1 28.03,108.04 28.03,107.76 27.23,106.96 26.95,106.96 R14.2
INT1  (via drill 0.35)
  Top 0.305: 29.21,20.32 AR3.2 v29.21,31.75 | v31.75,38.1 31.75,44.45 30.48,45.72 v29.21,45.72
  Bottom 0.305: v29.21,31.75 29.21,35.56 v31.75,38.1
  Bottom 0.61: BM1PINS.2 v29.21,45.72
INT2  (via drill 0.35)
  Top 0.305: BM2PINS.2 50.8,52.07 v43.18,52.07 | v41.91,43.18 39.17,40.44 38.17,40.44 35.83,38.1 v34.29,38.1 | v34.29,31.75 38.1,31.75 39.37,30.48 39.37,21.59 AR4.2
  Bottom 0.305: v43.18,52.07 43.18,44.45 v41.91,43.18 | v34.29,38.1 v34.29,31.75
N$1  (via drill 0.35)
  Top 0.305: v34.29,88.9 34.29,92.71 33.02,93.98 D3.A | IC2.1 C3.1 51.97,64.59 51.97,60.94 48.77,57.73 47.85,57.73 47.4,58.19 47.4,67.23 46.38,68.25 41.43,68.25 38.71,70.97 38.71,79.91 36.88,81.74 36.88,82.42 R2.2
  Bottom 0.305: v34.29,88.9 34.29,85.09 R2.2 36.88,82.65 41.91,82.65 R1.1
N$2  (via drill 0.35)
  Top 0.305: v143.51,59.69 182.88,59.69 196.85,73.66 v196.85,74.93 | v22.86,29.21 v22.86,26.67
  Bottom 0.305: v143.51,59.69 139.7,59.69 130.81,50.8 128.27,50.8 121.92,57.15 74.93,57.15 69.85,52.07 49.53,52.07 46.99,49.53 46.99,33.02 43.18,29.21 v22.86,29.21 | v196.85,74.93 US9.3 | AR8.3 v22.86,26.67
N$4  (via drill 0.35)
  Top 0.305: v48.77,79.22 47.17,80.82 47.17,82.42 R3.1 | v36.42,79.22 36.34,79.22
  Top 0.61: IC1.5 36.34,69.05 36.34,79.22 36.34,80.32 34.29,82.37 34.29,82.55 R5.2
  Bottom 0.305: v36.42,79.22 v48.77,79.22
N$5
  Top 0.305: C6.1 Q2.3 58.25,107 Q1.2 56.66,105.41 52.07,105.41 C5.2 50.8,105.41 R9.1
N$6
  Bottom 0.61: US3.3 181.61,73.66 142.24,34.29 74.93,34.29 72.39,31.75 59.69,31.75 AR5.3
N$7  (via drill 0.35)
  Top 0.305: C6.2 54.74,113.03 56.05,114.34 Q2.2 | v39.37,100.33 41.91,97.79 49.53,97.79 52.07,100.33 R10.1
  Bottom 0.305: C6.2 45.66,107.89 45.66,107.82 39.37,101.54 v39.37,100.33
N$8  (via drill 0.35)
  Top 0.305: AR2.2 20.26,20.38 20.26,20.45 19.55,21.16 19.48,21.16 16.51,24.13 16.51,33.02 7.62,33.02 5.08,35.56 5.08,76.2 v5.11,76.25 | v19.51,100.94 23.52,104.95 35.84,104.95 40.31,100.48 42.82,100.48 50.14,107.8 51.05,107.8 51.97,106.88 56.08,106.88 Q1.1
  Bottom 0.305: v19.51,100.94 19.51,89.38 6.38,76.25 v5.11,76.25
N$9
  Bottom 0.61: US2.3 170.18,92.71 175.26,87.63 175.26,74.93 140.97,40.64 74.93,40.64 | 74.88,40.64 74.93,40.64 | AR5.2 45.63,20.23 45.63,20.51 59.41,34.29 68.58,34.29 74.93,40.64
N$10
  Top 0.305: AR2.1 13.97,24.13 11.43,24.13 3.81,31.75 3.81,76.2 3.73,76.25 15.16,87.68 15.16,95.23 15.24,95.25 15.24,111.76 16.51,113.03 38.1,113.03 39.37,111.76 45.72,111.76 45.72,112.54 46.97,113.78 46.97,115.55 49.53,118.11 52.07,118.11 53.34,116.84 55.73,116.84 Q2.1
N$12  (via drill 0.35)
  Top 0.305: AR1.2 12.64,20.38 12.64,20.45 2.54,30.54 2.54,81.28 v2.82,81.28 | v39.85,90.65 39.85,91.34 38.71,92.48 38.71,94.31 33.22,99.8 30.71,99.8 27.28,103.23 24.77,103.23 v18.82,97.28
  Bottom 0.305: v39.85,90.65 41.45,89.05 47.4,89.05 48.31,89.97 51.97,89.97 R16.2 | v2.82,81.28 5.36,81.28 18.82,94.74 v18.82,97.28
N$13
  Bottom 0.61: AR5.1 41.82,19.14 41.82,21.78 63.22,43.18 133.35,43.18 157.48,67.31 US1.3
N$14  (via drill 0.35)
  Top 0.305: AR6.3 57.15,21.59 59.69,24.13 v63.5,24.13
  Bottom 0.305: v63.5,24.13 US6.3
N$15  (via drill 0.35)
  Top 0.305: AR6.2 54.61,21.59 59.69,26.67 v63.5,26.67
  Bottom 0.305: v63.5,26.67 71.12,26.67 72.39,25.4 195.58,25.4 196.85,26.67 196.85,33.02 198.12,34.29 US5.3
N$16  (via drill 0.35)
  Top 0.305: AR6.1 52.07,21.59 59.69,29.21 v63.5,29.21
  Bottom 0.305: v63.5,29.21 73.66,29.21 77.47,33.02 153.67,33.02 165.1,44.45 US4.3
N$17  (via drill 0.35)
  Top 0.305: v68.58,21.59 68.58,31.75 66.04,34.29 17.78,34.29 15.24,36.83 15.24,44.45 HM1.3
  Bottom 0.305: AR7.2 64.77,20.32 66.04,21.59 v68.58,21.59
N$18
  Top 0.305: D5.A 38.1,92.71 38.1,88.9 43.18,83.82 43.74,83.82 | 43.74,83.82 44.45,83.82 44.45,78.74 48.26,78.74 48.26,74.93 47.16,73.83 Q3.2 | U5.6 U5.5 72.54,109.17 72.54,108.71 73.69,107.57 73.91,107.57 74.37,107.11 74.37,100.03 72.54,98.2 70.81,98.2 70.48,98.53 70.48,104.5 70.16,104.83 58.83,104.83 52.88,98.88 52.88,96.14 51.74,95 45.57,95 43.74,93.17 43.74,83.82 | 43.74,83.8 43.74,83.82
N$19  (via drill 0.35)
  Top 0.305: v138.43,54.61 182.88,54.61 v193.04,64.77
  Bottom 0.305: AR8.2 13.97,27.94 43.18,27.94 48.26,33.02 48.26,40.64 57.15,49.53 133.35,49.53 v138.43,54.61 | v193.04,64.77 US8.3
N$20  (via drill 0.35)
  Top 0.305: v134.62,48.26 186.69,48.26 v193.04,54.61 | AR8.1 14.04,30.41 14.1,30.41 15.24,29.27 v15.24,25.4
  Bottom 0.305: v134.62,48.26 132.08,45.72 62.23,45.72 41.91,25.4 v15.24,25.4 | v193.04,54.61 US7.3
N$21  (via drill 0.35)
  Top 0.61: v156.21,41.91 149.86,35.56 v20.32,35.56
  Bottom 0.61: US12.3 192.32,98.34 192.32,74.3 184.5,66.47 180.78,66.47 v156.21,41.91 | v20.32,35.56 13.97,35.56 AR9.3
N$22  (via drill 0.35)
  Top 0.61: v149.86,38.1 68.58,38.1 66.04,40.64 46.99,40.64 45.72,39.37 v45.72,38.1
  Bottom 0.61: US11.3 203.29,94.07 203.01,94.07 194.31,85.37 194.31,69.85 180.34,55.88 173.99,55.88 156.21,38.1 v149.86,38.1 | v45.72,38.1 44.45,38.1 40.64,41.91 20.32,41.91 17.78,39.37 AR9.2
N$23  (via drill 0.35)
  Top 0.61: v198.12,82.55 198.12,81.28 193.93,77.09 193.93,73.22 182.94,62.23 v147.32,62.23
  Bottom 0.61: US10.3 203.29,83.91 203.01,83.91 201.65,82.55 v198.12,82.55 | v147.32,62.23 69.85,62.23 68.58,60.96 43.18,60.96 40.64,58.42 40.64,44.45 39.37,43.18 13.97,43.18 AR9.1
N$24  (via drill 0.35)
  Top 0.305: v47.17,74.88 44.42,74.88 43.51,73.97 Q3.1 | v50.37,76.71 50.37,80.82 51.97,82.42 R16.1
  Bottom 0.305: v47.17,74.88 48.54,74.88 v50.37,76.71
N$25
  Top 0.305: Q4.1 43.51,65.05 44.42,65.96 46.03,65.96 46.94,65.05 46.94,58.42 46.94,57.96 46.94,57.2 48.01,56.13 48.77,56.13 55.17,62.53 58.37,62.53 60.88,65.05 60.88,66.88 65.46,71.45 65.68,71.45 65.91,71.68 65.91,80.59 65,81.51 61.8,81.51 57.23,86.08 57.23,89.97 R17.1
N$26  (via drill 0.35)
  Top 0.305: v49,60.02 49,65.73 53.11,69.85 53.11,74.19 52.65,74.65 52.2,74.65 51.05,75.79 51.05,78.31 55.17,82.42 57,82.42 R17.2
  Bottom 0.305: v49,60.02 43.74,60.02 42.37,58.65 42.37,57.73 46.48,53.62 46.48,35.33 42.14,30.99 16.08,30.99 14.02,33.05 11.28,33.05 10.59,32.36 10.59,19.79 10.74,19.63 11.28,19.1 AR1.1
N$27  (via drill 0.35)
  Top 0.305: v86.36,90.17 83.82,87.63 74.93,87.63 74.93,59.69 73.66,58.42 v59.69,58.42 | v48.26,58.42 48.26,68.58 44.45,72.39 41.91,72.39 39.37,74.93 39.37,82.55 38.1,83.82 27.94,83.82 R8.1
  Bottom 0.305: R13.2 124.46,91.44 123.19,92.71 88.9,92.71 v86.36,90.17 | v59.69,58.42 v48.26,58.42
N$28  (via drill 0.35)
  Top 0.305: v82.83,97.51 143.49,97.51 149.56,103.58 165.35,103.58 167.41,101.52 v167.41,93.62
  Bottom 0.305: v82.83,97.51 76.2,97.51 68.89,90.2 67.51,90.2 R22.1 | v167.41,93.62 167.41,90.42 167.64,90.2 R21.2
N$29
  Top 0.305: Q1.3 50.97,109.05 C5.1 46.99,105.41 45.72,105.41 R6.1
N$30  (via drill 0.35)
  Top 0.305: v63.86,107.8 64.31,107.34 64.31,106.66 U4.3
  Bottom 0.305: v63.86,107.8 62.94,107.8 57.91,102.77 54.71,102.77 46.94,95 46.48,95 46.03,94.54 46.03,93.4 46.94,92.48 60.66,92.48 62.03,93.85 R19.1
N$32  (via drill 0.35)
  Top 0.305: v182.88,90.17 169.67,90.17 168.04,91.8 164.19,91.8 v162.56,90.17 | v158.75,92.71 152.4,92.71 v149.86,95.25 | v86.36,99.06 v81.28,99.06 | v64.77,90.17 62.23,92.71 v44.45,92.71 | v25.4,91.44 22.86,91.44 R12.1
  Bottom 0.305: v162.56,90.17 158.75,90.17 v158.75,92.71 | v149.86,95.25 88.9,95.25 86.36,97.79 v86.36,99.06 | v64.77,90.17 67.61,93.02 70.8,93.02 76.85,99.06 v81.28,99.06 | v44.45,92.71 38.1,92.71 36.83,91.44 34.29,91.44 33.02,92.71 32.51,92.71 32.15,92.35 26.31,92.35 v25.4,91.44
  Bottom 0.61: R23.2 188.93,90.17 187.15,88.39 186.23,88.39 184.45,90.17 v182.88,90.17
N$33  (via drill 0.35)
  Top 0.61: U5.3 73.66,106.33 v73.66,104.14
  Bottom 0.61: v73.66,104.14 72.39,102.87 60.96,102.87 58.42,100.33 58.42,93.98 R20.1
N$35  (via drill 0.35)
  Top 0.61: R14.1 19.05,91.44 v19.05,81.28 | v81.28,96.52 82.55,95.25 97.79,95.25 R11.2
  Bottom 0.61: v19.05,81.28 68.58,81.28 69.85,82.55 69.85,90.17 76.2,96.52 v81.28,96.52
N$36
  Bottom 0.305: R18.1 30.48,80.01 69.85,80.01 71.12,81.28 71.12,86.36 73.03,88.27 79.38,88.27 R7.2
N$37  (via drill 0.35)
  Top 0.61: R15.1 143.51,92.71 144.78,93.98 148.59,93.98 149.86,92.71 v149.86,90.17 v154.94,90.17 | R21.1 165.1,88.9 166.37,87.63 184.15,87.63 R23.1 190.06,86.8 195.05,86.8 199.39,82.46 199.39,50.61 198.63,49.85 198.63,23.37 v195.58,20.32 | v160.02,69.85 v154.94,69.85 | v76.2,93.98 74.93,95.25 v74.93,99.06
  Bottom 0.305: R9.2 47.17,93.85 50.83,93.85 51.74,92.94 59.74,92.94 66.6,99.8 74.14,99.8 74.83,99.11 v74.93,99.06 | 188.19,21.36 187.99,21.16 BT7.GND@1
  Bottom 0.61: BT11.GND@1 120.61,21.44 122.44,23.27 145.55,23.27 147.38,21.44 BT8.GND@1 170.04,17.78 183.04,17.78 186.7,21.44 BT7.GND@1 189.24,20.17 189.24,20.32 v195.58,20.32 | v149.86,90.17 149.86,87.79 BT9.PWR@1 BT10.PWR@1 111.6,71.12 90.17,71.12 86.36,74.93 86.36,80.01 83.67,82.7 BT12.PWR@1 82.55,85.25 82.55,92.71 81.28,93.98 v76.2,93.98 | R21.1 160.02,85.09 v160.02,69.85 | v154.94,69.85 v154.94,90.17 | 188.19,21.36 187.96,21.59
N$38
  Bottom 0.61: R15.2 143.51,87.63 86.36,87.63 83.82,90.17 83.82,99.06 81.28,101.6 R24.1
POL1  (via drill 0.35)
  Top 0.305: AR3.1 17.78,27.94 17.78,33.02 16.51,34.29 8.89,34.29 6.35,36.83 6.35,53.34 7.62,54.61 v15.24,54.61 | v24.13,50.8 27.94,50.8 BM1PINS.3
  Bottom 0.305: v15.24,54.61 21.59,54.61 24.13,52.07 v24.13,50.8
POL2  (via drill 0.35)
  Top 0.305: AR4.1 31.75,21.59 31.75,31.75 33.02,33.02 40.64,33.02 v41.91,31.75 | v41.91,36.83 41.91,38.1 48.26,44.45 v49.53,44.45 | v77.47,52.07 71.12,52.07 66.04,57.15 58.42,57.15 BM2PINS.3
  Bottom 0.305: v41.91,31.75 v41.91,36.83 | v49.53,44.45 55.88,50.8 76.2,50.8 v77.47,52.07